# EAGLE design BigTimeMain (EAGLE 7.6.0)
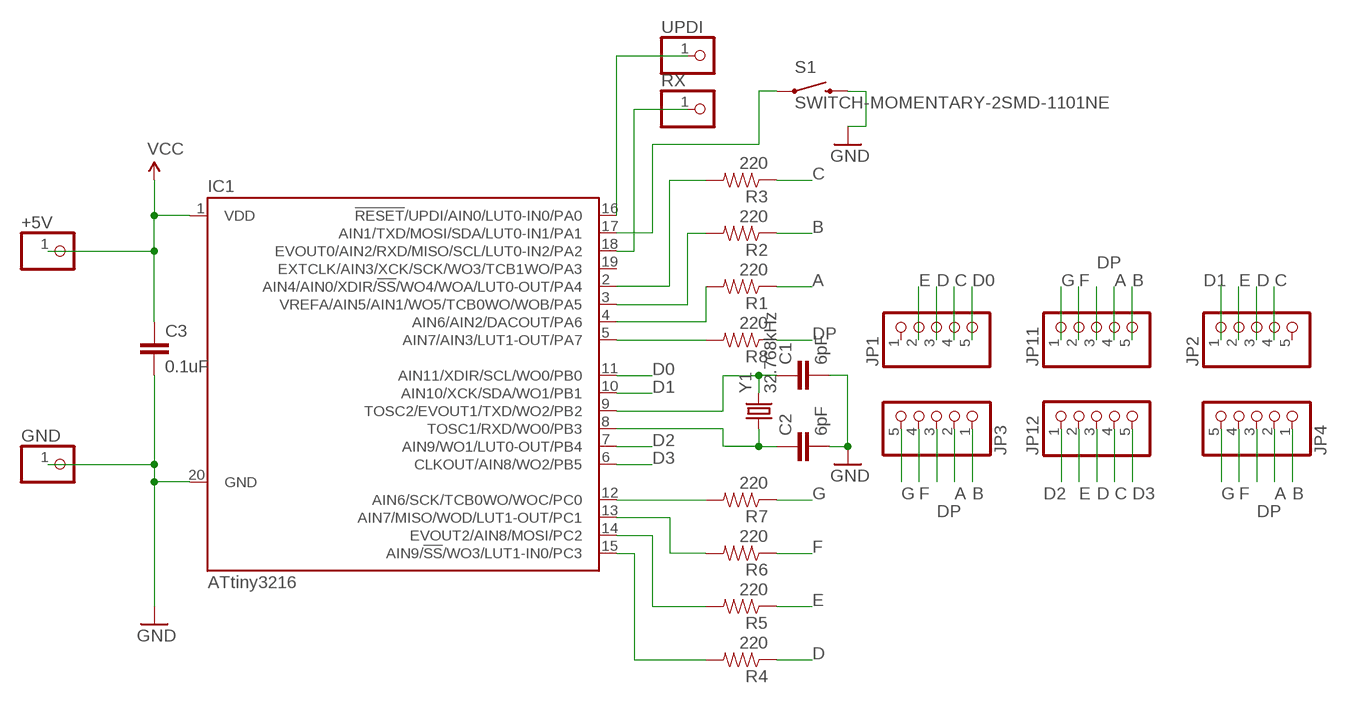
[diagram p0: schematic, sheet 1]

## Parts
+5V  PINHD-1X1  [1X01]
C1  6pF  CAP0805  [0805]
C2  6pF  CAP0805  [0805]
C3  0.1uF  CAP0805  [0805]
GND  PINHD-1X1  [1X01]
IC1  ATtiny3216  ATTINY1616/3216-S*  [SOIC300]
JP1  HEADER-1X576MIL  [1X05_ROUND_76]
JP2  HEADER-1X576MIL  [1X05_ROUND_76]
JP3  HEADER-1X576MIL  [1X05_ROUND_76]
JP4  HEADER-1X576MIL  [1X05_ROUND_76]
JP11  HEADER-1X576MIL  [1X05_ROUND_76]
JP12  HEADER-1X576MIL  [1X05_ROUND_76]
R1  220  0.3OHM-1/8W-1%(0805)  [0805]
R2  220  0.3OHM-1/8W-1%(0805)  [0805]
R3  220  0.3OHM-1/8W-1%(0805)  [0805]
R4  220  0.3OHM-1/8W-1%(0805)  [0805]
R5  220  0.3OHM-1/8W-1%(0805)  [0805]
R6  220  0.3OHM-1/8W-1%(0805)  [0805]
R7  220  0.3OHM-1/8W-1%(0805)  [0805]
R8  220  0.3OHM-1/8W-1%(0805)  [0805]
RX  PINHD-1X1  [1X01]
S1  SWITCH-MOMENTARY-2SMD-1101NE  [TACTILE-SWITCH-1101NE]
UPDI  PINHD-1X1  [1X01]
Y1  32.768kHz  CRYSTAL3.2X1.5MM  [CRYSTAL-SMD-3.2X1.5MM]

## Nets
A: JP3.2 JP4.2 JP11.4 R1.1
B: JP3.1 JP4.1 JP11.5 R2.1
C: JP1.4 JP2.4 JP12.4 R3.1
D: JP1.3 JP2.3 JP12.3 R4.1
D0: IC1.11(AIN11/XDIR/SCL/WO0/PB0) JP1.5
D1: IC1.10(AIN10/XCK/SDA/WO1/PB1) JP2.1
D2: IC1.7(AIN9/WO1/LUT0-OUT/PB4) JP12.1
D3: IC1.6(CLKOUT/AIN8/WO2/PB5) JP12.5
DP: JP3.3 JP4.3 JP11.3 R8.1
E: JP1.2 JP2.2 JP12.2 R5.1
F: JP3.4 JP4.4 JP11.2 R6.1
G: JP3.5 JP4.5 JP11.1 R7.1
GND: C1.2 C2.2 C3.2 GND.1 IC1.20(GND) S1.2
N$1: C1.1 IC1.9(TOSC2/EVOUT1/TXD/WO2/PB2) Y1.P$2
N$3: C2.1 IC1.8(TOSC1/RXD/WO0/PB3) Y1.P$1
N$6: IC1.16(!RESET!/UPDI/AIN0/LUT0-IN0/PA0) UPDI.1
N$7: IC1.4(AIN6/AIN2/DACOUT/PA6) R1.2
N$9: IC1.3(VREFA/AIN5/AIN1/WO5/TCB0WO/WOB/PA5) R2.2
N$12: IC1.2(AIN4/AIN0/XDIR/!SS!/WO4/WOA/LUT0-OUT/PA4) R3.2
N$13: IC1.15(AIN9/!SS!/WO3/LUT1-IN0/PC3) R4.2
N$18: IC1.14(EVOUT2/AIN8/MOSI/PC2) R5.2
N$19: IC1.18(EVOUT0/AIN2/RXD/MISO/SCL/LUT0-IN2/PA2) RX.1
N$20: IC1.13(AIN7/MISO/WOD/LUT1-OUT/PC1) R6.2
N$21: IC1.12(AIN6/SCK/TCB0WO/WOC/PC0) R7.2
N$22: IC1.5(AIN7/AIN3/LUT1-OUT/PA7) R8.2
N$23: IC1.17(AIN1/TXD/MOSI/SDA/LUT0-IN1/PA1) S1.1
VCC: +5V.1 C3.1 IC1.1(VDD)
Unconnected: IC1.19(EXTCLK/AIN3/XCK/SCK/WO3/TCB1WO/PA3) JP1.1 JP2.5

## Library data of the parts
+5V GND RX UPDI = adafruit:PINHD-1X1: Pin header 1x1 for 0.1" spacing With round pins
C1-C3 = SparkFun-Capacitors:CAP: Capacitor Standard 0603 ceramic capacitor, and 0.1" leaded capacitor.
IC1 = m_microcontroller:ATTINY1616/3216: ATtiny1616/3216 tinyAVR® 1-series Introduction The ATtiny1616/3216 are members of the tinyAVR® 1-series of microcontrollers, using the AVR® processor with hardware multiplier, running at up to 20 MHz, with 16/32 KB Flash, 2 KB of SRAM, and 256 bytes of EEPROM in a 20-pin package. The tinyAVR® 1-series uses the latest technologies with a flexible, low-power architecture including Event System and SleepWalking, accurate analog features, and Core Independent Peripherals. Capacitive touch interfaces with driven shield are supported with the integrated QTouch® peripheral touch controller. Features CPU AVR® CPU Running at up to 20 MHz Single-cycle I/O access Two-level interrupt controller Two-cycle hardware multiplier Memories 32/16 KB In-system self-programmable Flash memory 256 bytes EEPROM 2 KB SRAM Write/erase endurance: Flash 10,000 cycles EEPROM 100,000 cycles Data retention: 40 years at 55°C System Power-on Reset (POR) Brown-out Detector (BOD) Clock options: 16/20 MHz low-power internal RC oscillator 32.768 kHz Ultra Low-Power (ULP) internal RC oscillator 32.768 kHz external crystal oscillator External clock input Single-pin Unified Program and Debug Interface (UPDI) Three sleep modes: Idle with all peripherals running for immediate wake-up Standby Configurable operation of selected peripherals SleepWalking peripherals Power-Down with full data retention Peripherals One 16-bit Timer/Counter type A (TCA) with dedicated period register and three compare channels Two 16-bit Timer/Counter type B (TCB) with input capture One 12-bit Timer/Counter type D (TCD) optimized for control applications One 16-bit Real-Time Counter (RTC) running from an external crystal, external clock, or internal RC oscillator Watchdog Timer (WDT) with Window mode, with a separate on-chip oscillator One USART with fractional baud rate generator, auto-baud, and start-of-frame detection One master/slave Serial Peripheral Interface (SPI) One Two-Wire Interface (TWI) with dual address match Philips I2C compatible Standard mode (Sm, 100 kHz) Fast mode (Fm, 400 kHz) Fast mode plus (Fm+, 1 MHz) Three Analog Comparators (AC) with low propagation delay Two 10-bit 115 ksps Analog-to-Digital Converters (ADC) Three 8-bit Digital-to-Analog Converters (DAC) with one external channel Multiple voltage references (VREF): 0.55V 1.1V 1.5V 2.5V 4.3V Event System (EVSYS) for CPU independent and predictable inter-peripheral signaling Configurable Custom Logic (CCL) with two programmable look-up tables Automated CRC memory scan Peripheral Touch Controller (PTC) Capacitive touch buttons, sliders, wheels and 2D surfaces Wake-up on touch Driven shield for improved moisture and noise handling performance Up to 12 self capacitance channels Up to 36 mutual capacitance channels External interrupt on all general purpose pins I/O and Packages: 18 programmable I/O lines 20-pin VQFN 3x3 mm 20-pin SOIC300 Temperature Ranges: -40°C to 105°C -40°C to 125°C Speed Grades: 0-5 MHz @ 1.8V - 5.5V 0-10 MHz @ 2.7V - 5.5V 0-20 MHz @ 4.5V - 5.5V Octopart Search <https://octopart.com/search?q=attiny3216-*> Added 2019-08-30; MANUF: Microchip; PARTNUM: ATtiny3216-S*
JP1-JP4 JP11 JP12 = microbuilder:HEADER-1X5: PIN HEADER
R1-R8 = SparkFun-Resistors:0.3OHM-1/8W-1%(0805): RES-11622; PROD_ID: RES-11622; VALUE: 0.3
S1 = SparkFun-Electromechanical:SWITCH-MOMENTARY-2: Various NO switches- pushbuttons, reed, etc; PROD_ID: SWCH-00815
Y1 = SparkFun-FreqCtrl:CRYSTAL: Various standard crystals. Proven footprints.; PROD_ID: XTAL-13062

## Board
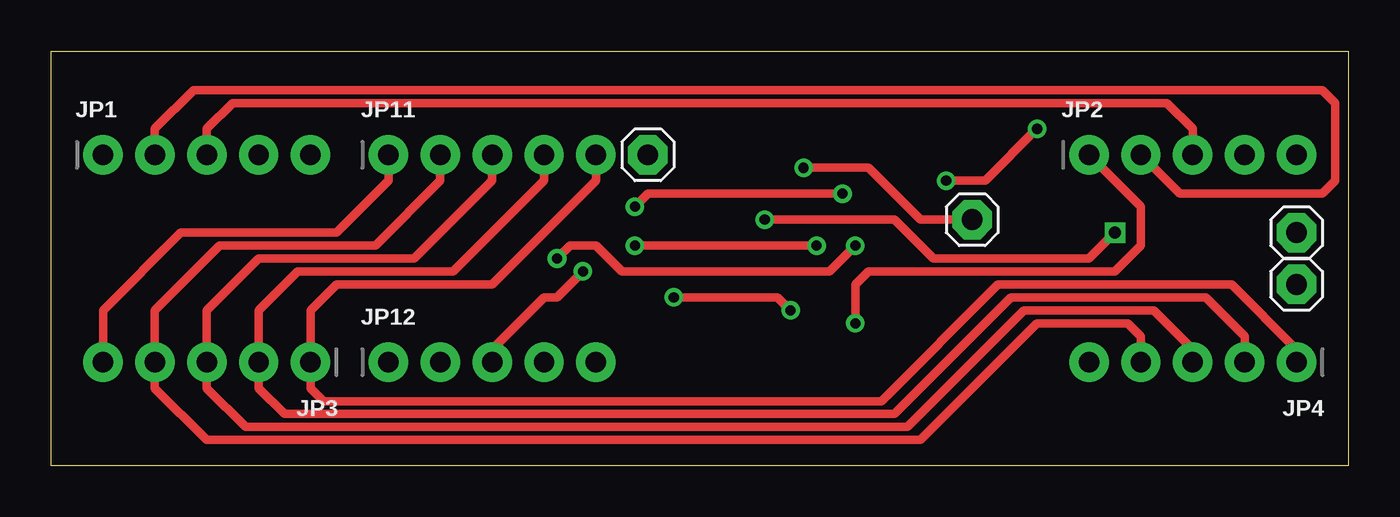
[diagram p1: board, top side]
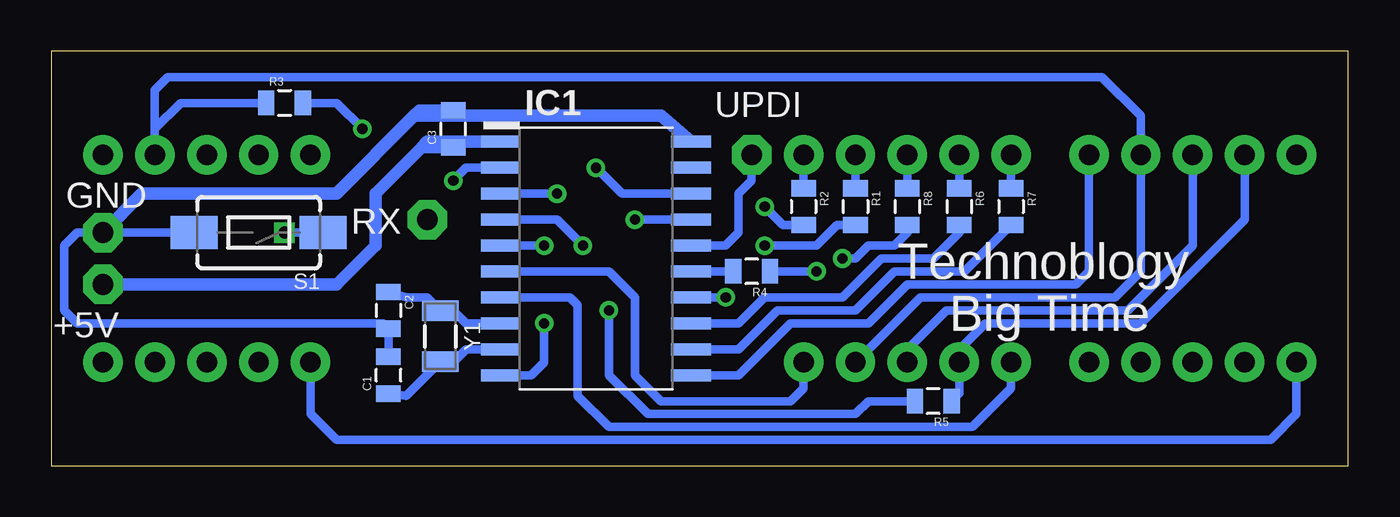
[diagram p2: board, bottom side, seen from below]

Size 63.5 x 20.32 mm. Coordinates in mm from the lower left corner, seen from the top.
Outline: 0,0 0,20.32 63.5,20.32 63.5,0 0,0
Copper layers (1*16): Top 0.035mm / dielectric 1.5mm / Bottom 0.035mm
Design rules "default *": minimum track width 8mil, minimum drill 15.5mil, track to track 8mil, track to pad 8mil, pad to pad 8mil, via to via 8mil, smd to smd 8mil, copper to edge 10mil, drill to drill 8mil, minimum pad ring 10mil, minimum via ring 8mil, stop-mask expansion 2mil, vias tented up to drill 20mil, thermal gap 10mil

### Footprints (pad centres in the part's own frame; a part is rotated, then mirrored left to right if it is on the bottom)
1X01 = drill 1.016 pad 1.93 octagon: 1 0,0
0805 = smd 0.8 x 1.2: 1 -0.9,0; 2 0.9,0
SOIC300 = smd 0.6 x 2: 1 -5.715,-4.65; 2 -4.445,-4.65; 3 -3.175,-4.65; 4 -1.905,-4.65; 5 -0.635,-4.65; 6 0.635,-4.65; 7 1.905,-4.65; 8 3.175,-4.65; 9 4.445,-4.65; 10 5.715,-4.65; 11 5.715,4.65; 12 4.445,4.65; 13 3.175,4.65; 14 1.905,4.65; 15 0.635,4.65; 16 -0.635,4.65; 17 -1.905,4.65; 18 -3.175,4.65; 19 -4.445,4.65; 20 -5.715,4.65
1X05_ROUND_76 = drill 1 pad 1.93: 1 -5.08,0; 2 -2.54,0; 3 0,0; 4 2.54,0; 5 5.08,0
TACTILE-SWITCH-1101NE = smd 2.3 x 1.6: 1 -3.15,0; 2 3.15,0
CRYSTAL-SMD-3.2X1.5MM = smd 1 x 1.8: P$1 -1.25,0; P$2 1.25,0

### Placement (x,y rotation side)
+5V  60.96,8.89 0 top
C1  46.99,4.45 90 bottom
C2  46.99,7.62 270 bottom
C3  43.81,16.51 90 bottom
GND  60.96,11.43 0 top
IC1  36.83,10.16 270 bottom
JP1  7.62,15.24 0 top
JP2  55.88,15.24 0 top
JP3  7.62,5.08 180 top
JP4  55.88,5.08 180 top
JP11  21.59,15.24 0 top
JP12  21.59,5.08 0 top
R1  24.13,12.7 270 bottom
R2  26.67,12.7 270 bottom
R3  52.07,17.78 0 bottom
R4  29.21,9.53 180 bottom
R5  20.32,3.18 180 bottom
R6  19.05,12.7 270 bottom
R7  16.51,12.7 270 bottom
R8  21.59,12.7 270 bottom
RX  45.09,12.06 0 top
S1  53.34,11.43 180 bottom
UPDI  29.21,15.24 0 top
Y1  44.45,6.35 270 bottom

### Tracks (layer width: path | path; a pad name or v marks a point on that pad's centre or on a via)
A
  Top 0.406: JP11.4 24.13,13.97 19.68,9.53 12.06,9.53 10.16,7.62 JP3.2 10.16,3.81 11.43,2.54 41.27,2.54 46.99,8.26 56.52,8.26 58.42,6.35 JP4.2
  Bottom 0.406: R1.1 JP11.4
B
  Top 0.406: JP11.5 26.67,13.97 21.59,8.89 13.97,8.89 12.7,7.62 JP3.1 12.7,3.81 13.34,3.18 40.64,3.18 46.35,8.89 57.78,8.89 60.96,5.71 JP4.1
  Bottom 0.406: R2.1 JP11.5
C
  Bottom 0.406: JP12.4 20.95,8.26 11.43,8.26 10.16,9.53 JP1.4 10.16,17.15 12.06,19.05 57.78,19.05 58.42,18.41 JP2.4 58.42,16.51 57.15,17.78 R3.1
D  (via drill 0.5)
  Top 0.406: JP1.3 7.62,16.51 8.89,17.78 54.61,17.78 55.88,16.51 JP2.3 | JP12.3 21.59,5.71 24.13,8.26 24.77,8.26 v26.04,9.53
  Bottom 0.406: JP1.3 7.62,10.79 10.79,7.62 19.68,7.62 21.59,5.71 JP12.3 | R4.1 v26.04,9.53
D0
  Bottom 0.406: IC1.11 29.84,4.45 27.3,6.99 23.5,6.99 21.59,8.89 13.34,8.89 12.7,9.53 JP1.5
D1  (via drill 0.5)
  Top 0.406: v39.37,6.99 39.37,8.89 40.01,9.53 52.07,9.53 53.34,10.79 53.34,12.7 JP2.1
  Bottom 0.406: v39.37,6.99 39.37,5.08 40.01,4.45 IC1.10
D2
  Bottom 0.406: IC1.7 38.1,8.26 37.73,7.88 37.73,3.44 36.2,1.91 18.41,1.91 16.51,3.81 JP12.1
D3
  Bottom 0.406: IC1.6 36.2,9.53 34.92,8.26 34.92,4.45 33.66,3.18 27.3,3.18 26.67,3.81 JP12.5
DP
  Top 0.406: JP11.3 21.59,13.97 17.78,10.16 10.16,10.16 7.62,7.62 JP3.3 7.62,3.81 9.53,1.91 41.91,1.91 47.62,7.62 53.98,7.62 55.88,5.71 JP4.3
  Bottom 0.406: R8.1 JP11.3
E
  Top 0.406: JP1.2 5.08,16.51 6.99,18.41 62.23,18.41 62.87,17.78 62.87,13.97 62.23,13.33 55.24,13.33 JP2.2
  Bottom 0.406: JP1.2 5.08,12.06 10.16,6.99 17.78,6.99 19.05,5.71 JP12.2 19.05,3.54 R5.1
F
  Top 0.406: JP11.2 19.05,13.97 15.88,10.79 8.26,10.79 5.08,7.62 JP3.4 5.08,3.81 7.62,1.27 42.55,1.27 48.26,6.99 52.7,6.99 53.34,6.35 JP4.4
  Bottom 0.406: R6.1 JP11.2
G
  Top 0.406: JP3.5 2.54,7.62 6.35,11.43 13.97,11.43 16.51,13.97 JP11.1
  Bottom 0.406: R7.1 JP11.1 | JP4.5 50.8,2.54 49.53,1.27 3.81,1.27 2.54,2.54 JP3.5
GND
  Bottom 0.406: C1.2 C2.2 47.26,6.99 62.23,6.99 62.87,7.62 62.87,10.79 62.23,11.43 GND.1 S1.2
  Bottom 0.61: 45.72,17.15 49.53,13.33 59.05,13.33 GND.1 | IC1.20 33.66,17.15 45.72,17.15 | C3.2 45.45,17.41 45.72,17.15
N$1
  Bottom 0.406: IC1.9 43.18,5.71 43.8,5.1 Y1.P$2 46.12,3.43 C1.1
N$3
  Bottom 0.406: IC1.8 43.18,6.99 43.81,7.62 44.43,7.62 Y1.P$1 44.45,7.62 45.09,8.26 46.09,8.26 C2.1
N$6
  Bottom 0.406: UPDI.1 29.21,13.97 29.84,13.33 29.84,11.43 30.48,10.79 IC1.16
N$7  (via drill 0.5)
  Top 0.406: v28.57,10.79 v37.47,10.79
  Bottom 0.406: R1.2 25.03,11.8 26.04,10.79 v28.57,10.79 | v37.47,10.79 38.73,12.06 IC1.4
N$9  (via drill 0.5)
  Top 0.406: v28.57,12.7 29.21,13.33 v38.73,13.33
  Bottom 0.406: R2.2 27.68,11.8 v28.57,12.7 | v38.73,13.33 IC1.3
N$12  (via drill 0.5)
  Top 0.406: v43.81,13.97 45.72,13.97 v48.26,16.51
  Bottom 0.406: v48.26,16.51 49.53,17.78 R3.2 | IC1.2 43.18,14.6 v43.81,13.97
N$13
  Bottom 0.406: R4.2 IC1.15
N$18  (via drill 0.5)
  Top 0.406: v36.2,7.62 35.56,8.26 v30.48,8.26
  Bottom 0.406: R5.2 23.5,3.18 24.13,2.54 34.29,2.54 36.2,4.45 v36.2,7.62 | v30.48,8.26 IC1.14
N$19  (via drill 0.5)
  Top 0.406: v36.83,14.6 40.01,14.6 42.55,12.06 RX.1
  Bottom 0.406: IC1.18 35.56,13.33 v36.83,14.6
N$20
  Bottom 0.406: IC1.13 29.84,6.99 28.57,8.26 24.77,8.26 22.86,10.16 20.32,10.16 19.05,11.43 R6.2
N$21
  Bottom 0.406: IC1.12 29.84,5.71 27.94,7.62 24.13,7.62 22.23,9.53 18.79,9.53 R7.2
N$22  (via drill 0.5)
  Top 0.406: v39.37,10.79 38.1,9.53 27.94,9.53 26.67,10.79 25.4,10.79 v24.77,10.16
  Bottom 0.406: R8.2 21.59,11.43 22.23,10.79 23.5,10.79 24.13,10.16 v24.77,10.16 | v39.37,10.79 IC1.5
N$23  (via drill 0.5, 0.6)
  Top 0.406: v34.92,12.06 41.27,12.06 43.18,10.16 50.8,10.16 v52.07,11.43
  Bottom 0.406: IC1.17 v34.92,12.06 | v52.07,11.43 S1.1
VCC
  Bottom 0.406: 41.91,15.88 IC1.1
  Bottom 0.61: 41.91,15.88 45.09,15.88 45.35,15.61 | +5V.1 49.53,8.89 47.62,10.79 47.62,13.33 45.35,15.61 | C3.1 45.35,15.61

### Text on the board
bPlace: Technoblogy | Big Time